# Altium project 红外数字模拟接收一体机.PrjPcb
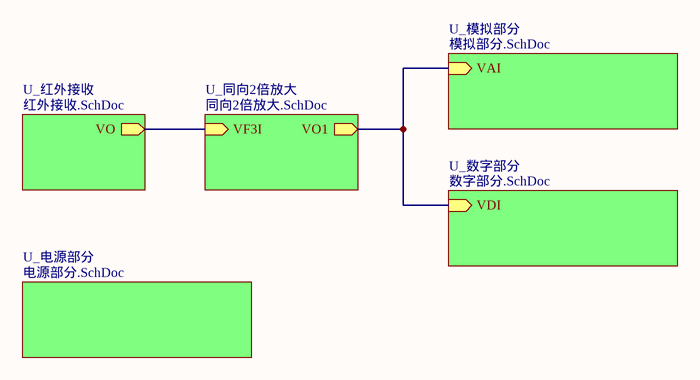
[diagram p0: 红外数字加模拟接收机.SchDoc]
15 sheets, 107 parts. Net scope: hierarchical (ports join the sheet entries above them; power ports are global).
Sheets:
  红外数字加模拟接收机.SchDoc
    U_模拟部分 = 模拟部分.SchDoc
      U_音频滤波 = 音频滤波.SchDoc
      U_功放TDA2030 = 功放TDA2030.SchDoc
    U_数字部分 = 数字部分.SchDoc
      U_LCD1602液晶显示 = LCD1602液晶显示.SchDoc
      U_峰值检波 = 峰值检波.SchDoc
      U_同向100倍放大 = 同向100倍放大.SchDoc
      U_同向10倍放大 = 同向10倍放大.SchDoc
      U_窄带滤波60K = 窄带滤波60K.SchDoc
      U_比较器 = 比较器.SchDoc
      U_51 最小系统 = 51 最小系统.SchDoc
    U_红外接收 = 红外接收.SchDoc
    U_同向2倍放大 = 同向2倍放大.SchDoc
    U_电源部分 = 电源部分.SchDoc

## Sheet 红外数字加模拟接收机.SchDoc
size A4

### Sub-sheets
U_同向2倍放大 = 同向2倍放大.SchDoc: VO1 (out), VF3I (in)
U_数字部分 = 数字部分.SchDoc: VDI (in)
U_模拟部分 = 模拟部分.SchDoc: VAI (in)
U_电源部分 = 电源部分.SchDoc: no entries
U_红外接收 = 红外接收.SchDoc: VO (out)

### Nets
NetC13_2: sheet U_红外接收/VO, sheet U_同向2倍放大/VF3I
NetR16_2: sheet U_模拟部分/VAI, sheet U_数字部分/VDI, sheet U_同向2倍放大/VO1

### Notes on the sheet
- 标题
- 日期
- 红外数字模拟接收一体机
- 2015 5 29
- 作者
- 模电组
- 单位
- 电子技术协会

## Sheet 模拟部分.SchDoc
size A4
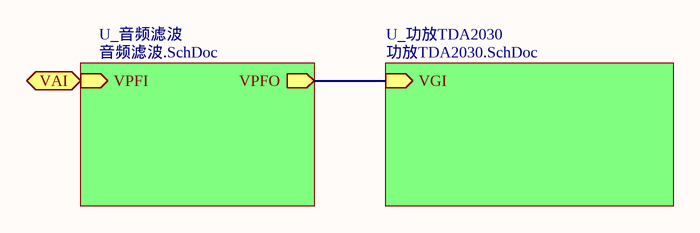
[diagram p1: 模拟部分.SchDoc]

### Sub-sheets
U_功放TDA2030 = 功放TDA2030.SchDoc: VGI (in)
U_音频滤波 = 音频滤波.SchDoc: VPFI (in), VPFO (out)

### Ports
VAI (in)

### Nets
NetR7_3: sheet U_音频滤波/VPFO, sheet U_功放TDA2030/VGI
NetR16_2: port VAI, sheet U_音频滤波/VPFI

### Notes on the sheet
- 标题
- 日期
- 红外数字模拟接收一体机
- 2015 5 29
- 作者
- 模电组
- 单位
- 电子技术协会

## Sheet 音频滤波.SchDoc
size A4
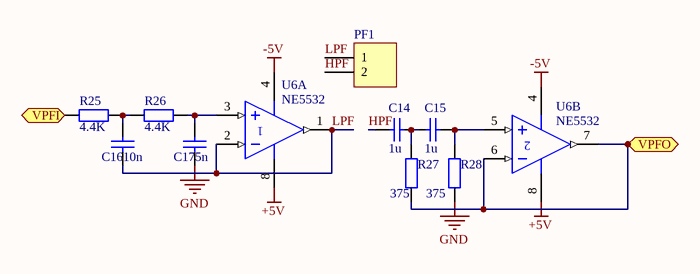
[diagram p2: 音频滤波.SchDoc]

### Parts
C14  瓷片电容  [瓷片电容]  (value not drawn)
C15  瓷片电容  [瓷片电容]  (value not drawn)
C16  瓷片电容  [瓷片电容]  (value not drawn)
C17  瓷片电容  [瓷片电容]  (value not drawn)
PF1  Header 2  [HDR1X2]  (value not drawn)
R25  value 4.4K  [AXIAL-0.4]  (hidden comment: Res2)
R26  value 4.4K  [AXIAL-0.4]  (hidden comment: Res2)
R27  value 375  [AXIAL-0.4]  (hidden comment: Res2)
R28  value 375  [AXIAL-0.4]  (hidden comment: Res2)
U6  NE5532  [JG008]  (parts A,B of 2)

### Ports
VPFI (in), VPFO (out)

### Nets
+5V: U6.8(V+)
-5V: U6.4(V-)
GND: C17.1 R28.1
HPF: C14.2 PF1.2
LPF: C16.1 PF1.1 U6.1(OUT) U6.2(IN-)
NetC14_1: C14.1 C15.2 R27.2
NetC15_1: C15.1 R28.2 U6.5(IN+)
NetC16_2: C16.2 R25.1 R26.2
NetC17_2: C17.2 R26.1 U6.3(IN+)
NetR7_3: R27.1 U6.6(IN-) U6.7(OUT) ; port VPFO
NetR16_2: R25.2 ; port VPFI

### Notes on the sheet
- 标题
- 日期
- 红外数字模拟接收一体机
- 2015 5 29
- 作者
- 模电组
- 单位
- 电子技术协会
- (in symbol 瓷片电容) 10n; 5n; 1u

### Library data of the parts
PF1 = Header 2: Header, 2-Pin; LatestRevisionDate: 17-Jul-2002; LatestRevisionNote: Re-released for DXP Platform.; Publisher: Altium Limited
R25-R28 = Res2: Resistor; Published: 8-Jun-2000; LatestRevisionDate: 17-Jul-2002; LatestRevisionNote: Re-released for DXP Platform.; PackageReference: AXIAL-0.4; Publisher: Altium Limited
U6 = NE5532AJG: Dual Low-Noise Operational Amplifier; Published: 15-Apr-2002; LatestRevisionDate: 04-Mar-2005; LatestRevisionNote: Stylized 3D Model Added.; DatasheetVersion: May-1988; PackageVersion: Jan-1995; PackageReference: JG008; Publisher: Altium Limited; PackageDescription: DIP; 8 Leads; Row Spacing 7.62 mm; Pitch 2.54 mm; ComponentLink1Description: Manufacturer Link; ComponentLink1URL: http://www.ti.com/; ComponentLink2Description: Datasheet; ComponentLink2URL: http://www-s.ti.com/sc/ds/ne5532a.pdf

## Sheet 功放TDA2030.SchDoc
size A4
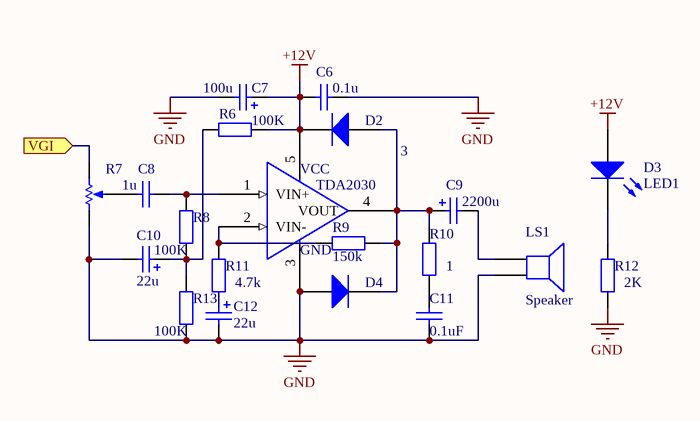
[diagram p3: 功放TDA2030.SchDoc]

### Parts
3  TDA2030  [TDA2030]
C6  瓷片电容  [瓷片电容]  (value not drawn)
C7  电解电容  [电解电容]  (value not drawn)
C8  独石电容  [独石电容]  (value not drawn)
C9  电解电容  [电解电容]  (value not drawn)
C10  电解电容  [电解电容]  (value not drawn)
C11  瓷片电容  [瓷片电容]  (value not drawn)
C12  电解电容  [电解电容]  (value not drawn)
D2  Diode 1N4007  [DO-41]  (value not drawn)
D3  LED1  [LED-1]
D4  Diode 1N4007  [DO-41]  (value not drawn)
LS1  Speaker  [PIN2]
R6  value 100K  [AXIAL-0.4]  (hidden comment: Res2)
R7  滑阻（功放用）  [多角滑阻]  (value not drawn)
R8  value 100K  [AXIAL-0.4]  (hidden comment: Res2)
R9  value 150k  [AXIAL-0.4]  (hidden comment: Res2)
R10  value 1  [AXIAL-0.4]  (hidden comment: Res2)
R11  value 4.7k  [AXIAL-0.4]  (hidden comment: Res2)
R12  value 2K  [AXIAL-0.4]  (hidden comment: Res2)
R13  value 100K  [AXIAL-0.4]  (hidden comment: Res2)

### Ports
VGI (in)

### Nets
+12V: 3.5(VCC) C6.1 C7.1 D2.2(K) D3.1(A) R6.2
GND: 3.3(GND) C6.2 C7.2 C10.2 C11.1 C12.2 D4.1(A) LS1.2 R7.1 R12.1 R13.1
Net3_1: 3.1(VIN+) C8.2 R8.2
Net3_2: 3.2(VIN-) R9.2 R11.2
Net3_4: 3.4(VOUT) C9.1 D2.1(A) D4.2(K) R9.1 R10.2
NetC8_1: C8.1 R7.2(TAP)
NetC9_2: C9.2 LS1.1
NetC10_1: C10.1 R6.1 R8.1 R13.2
NetC11_2: C11.2 R10.1
NetC12_1: C12.1 R11.1
NetD3_2: D3.2(K) R12.2
NetR7_3: R7.3 ; port VGI

### Notes on the sheet
- 标题
- 日期
- 红外数字模拟接收一体机
- 2015 5 29
- 作者
- 模电组
- 单位
- 电子技术协会
- (in symbol 独石电容) 1u
- (in symbol 瓷片电容) 0.1u; 0.1uF
- (in symbol 电解电容) 100u; 22u; 2200u

### Library data of the parts
D2 D4 = Diode 1N4007: 1 Amp General Purpose Rectifier; Published: 8-Jun-2000; LatestRevisionDate: 17-Jul-2002; LatestRevisionNote: Re-released for DXP Platform.; DatasheetDocument: 1998; PackageDocument: Aug-1999; PackageReference: DO-41; Publisher: Altium Limited; Code_JEDEC: DO-204-AL; ComponentLink1Description: Manufacturer Link; ComponentLink1URL: http://www.fairchildsemi.com/; ComponentLink2Description: Datasheet; ComponentLink2URL: http://www.fairchildsemi.com/ds/1N%2F1N4001.pdf
D3 = LED1: Typical RED GaAs LED; Published: 8-Jun-2000; LatestRevisionDate: 08-Jul-2005; LatestRevisionNote: Mech Layer 1 removed.; PackageReference: LED-1; Publisher: Altium Limited
LS1 = Speaker: Loudspeaker; Published: 24-Mar-1999; LatestRevisionDate: 17-Jul-2002; LatestRevisionNote: Re-released for DXP Platform.; PackageReference: PIN2; Publisher: Altium Limited
R6 R8-R13 = Res2: Resistor; Published: 8-Jun-2000; LatestRevisionDate: 17-Jul-2002; LatestRevisionNote: Re-released for DXP Platform.; PackageReference: AXIAL-0.4; Publisher: Altium Limited

## Sheet 数字部分.SchDoc
size A4
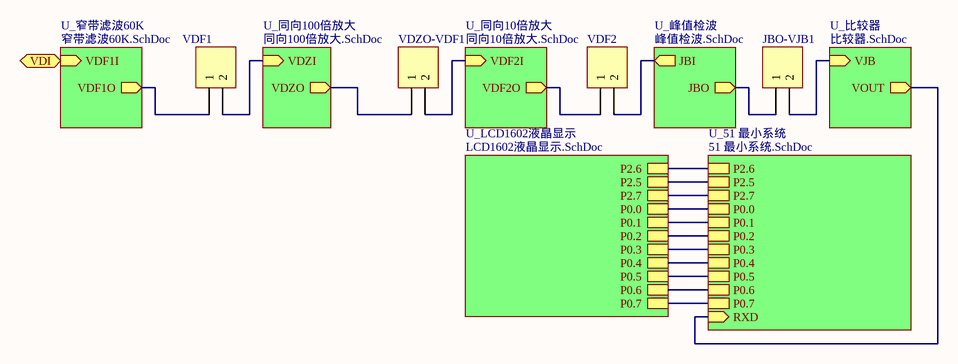
[diagram p4: 数字部分.SchDoc]

### Parts
JBO-VJB1  Header 2  [HDR1X2]  (value not drawn)
VDF1  Header 2  [HDR1X2]  (value not drawn)
VDF2  Header 2  [HDR1X2]  (value not drawn)
VDZO-VDF1  Header 2  [HDR1X2]  (value not drawn)

### Sub-sheets
U_51 最小系统 = 51 最小系统.SchDoc: P2.6, P2.5, P2.7, P0.0, P0.1, P0.2, P0.3, P0.4, P0.5, P0.6, P0.7, RXD (in)
U_LCD1602液晶显示 = LCD1602液晶显示.SchDoc: P2.6, P2.5, P2.7, P0.0, P0.1, P0.2, P0.3, P0.4, P0.5, P0.6, P0.7
U_同向10倍放大 = 同向10倍放大.SchDoc: VDF2I (in), VDF2O (out)
U_同向100倍放大 = 同向100倍放大.SchDoc: VDZI (in), VDZO (out)
U_峰值检波 = 峰值检波.SchDoc: JBI (out), JBO (out)
U_比较器 = 比较器.SchDoc: VJB (in), VOUT (out)
U_窄带滤波60K = 窄带滤波60K.SchDoc: VDF1I (in), VDF1O (out)

### Ports
VDI (in)

### Nets
Net1_10: sheet U_比较器/VOUT, sheet U_51 最小系统/RXD
Net1_26: sheet U_LCD1602液晶显示/P2.5, sheet U_51 最小系统/P2.5
Net1_27: sheet U_LCD1602液晶显示/P2.6, sheet U_51 最小系统/P2.6
Net1_28: sheet U_LCD1602液晶显示/P2.7, sheet U_51 最小系统/P2.7
Net1_32: sheet U_LCD1602液晶显示/P0.7, sheet U_51 最小系统/P0.7
Net1_33: sheet U_LCD1602液晶显示/P0.6, sheet U_51 最小系统/P0.6
Net1_34: sheet U_LCD1602液晶显示/P0.5, sheet U_51 最小系统/P0.5
Net1_35: sheet U_LCD1602液晶显示/P0.4, sheet U_51 最小系统/P0.4
Net1_36: sheet U_LCD1602液晶显示/P0.3, sheet U_51 最小系统/P0.3
Net1_37: sheet U_LCD1602液晶显示/P0.2, sheet U_51 最小系统/P0.2
Net1_38: sheet U_LCD1602液晶显示/P0.1, sheet U_51 最小系统/P0.1
Net1_39: sheet U_LCD1602液晶显示/P0.0, sheet U_51 最小系统/P0.0
NetC18_1: VDF1.1 ; sheet U_窄带滤波60K/VDF1O
NetC36_2: JBO-VJB1.1 ; sheet U_峰值检波/JBO
NetD1_1: VDF2.2 ; sheet U_峰值检波/JBI
NetJBO-VJB1_2: JBO-VJB1.2 ; sheet U_比较器/VJB
NetR16_2: port VDI, sheet U_窄带滤波60K/VDF1I
NetR19_2: VDF2.1 ; sheet U_同向10倍放大/VDF2O
NetR20_1: VDZO-VDF1.2 ; sheet U_同向10倍放大/VDF2I
NetR22_2: VDZO-VDF1.1 ; sheet U_同向100倍放大/VDZO
NetR23_1: VDF1.2 ; sheet U_同向100倍放大/VDZI

### Notes on the sheet
- 标题
- 日期
- 红外数字模拟接收一体机
- 2015 5 29
- 作者
- 模电组
- 单位
- 电子技术协会

### Library data of the parts
JBO-VJB1 VDF1 VDF2 VDZO-VDF1 = Header 2: Header, 2-Pin; LatestRevisionDate: 17-Jul-2002; LatestRevisionNote: Re-released for DXP Platform.; Publisher: Altium Limited

## Sheet LCD1602液晶显示.SchDoc
size A4
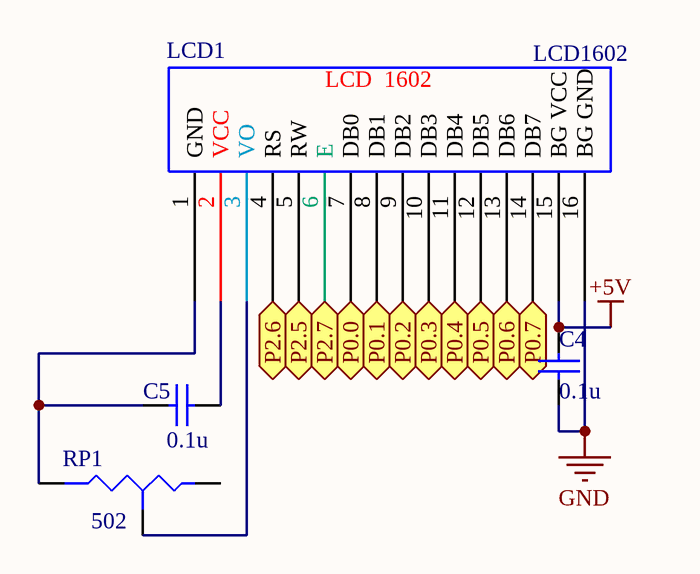
[diagram p5: LCD1602液晶显示.SchDoc]

### Parts
C4  瓷片电容  [瓷片电容]  (value not drawn)
C5  瓷片电容  [瓷片电容]  (value not drawn)
LCD1  LCD1602  [SIP16]
RP1  滑阻  [三脚滑阻]  (value not drawn)

### Ports
P0.0, P0.1, P0.2, P0.3, P0.4, P0.5, P0.6, P0.7, P2.5, P2.6, P2.7

### Nets
+5V: C4.1 LCD1.15(BG_VCC)
GND: C4.2 LCD1.16(BG_GND)
Net1_26: LCD1.5(RW) ; port P2.5
Net1_27: LCD1.4(RS) ; port P2.6
Net1_28: LCD1.6(E) ; port P2.7
Net1_32: LCD1.14(DB7) ; port P0.7
Net1_33: LCD1.13(DB6) ; port P0.6
Net1_34: LCD1.12(DB5) ; port P0.5
Net1_35: LCD1.11(DB4) ; port P0.4
Net1_36: LCD1.10(DB3) ; port P0.3
Net1_37: LCD1.9(DB2) ; port P0.2
Net1_38: LCD1.8(DB1) ; port P0.1
Net1_39: LCD1.7(DB0) ; port P0.0
NetC5_1: C5.1 LCD1.2(VCC)
NetC5_2: C5.2 LCD1.1(GND) RP1.3(B)
NetLCD1_3: LCD1.3(VO) RP1.2(TAP)

Not connected (* = marked no-connect by the designer): RP1 1(A)

### Notes on the sheet
- 标题
- 日期
- 红外数字模拟接收一体机
- 2015 5 29
- 作者
- 模电组
- 单位
- 电子技术协会
- (in symbol LCD1602) LCD  1602
- (in symbol 滑阻) 502
- (in symbol 瓷片电容) 0.1u

## Sheet 峰值检波.SchDoc
size A4
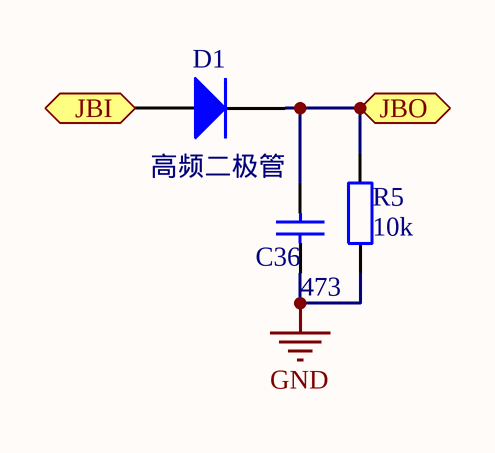
[diagram p6: 峰值检波.SchDoc]

### Parts
C36  瓷片电容  [瓷片电容]  (value not drawn)
D1  高频二极管  [DO-41]
R5  value 10k  [AXIAL-0.4]  (hidden comment: Res2)

### Ports
JBI (out), JBO (out)

### Nets
GND: C36.1 R5.1
NetC36_2: C36.2 D1.2(K) R5.2 ; port JBO
NetD1_1: D1.1(A) ; port JBI

### Notes on the sheet
- 标题
- 日期
- 红外数字模拟接收一体机
- 2015 5 29
- 作者
- 模电组
- 单位
- 电子技术协会
- (in symbol 瓷片电容) 473

### Library data of the parts
D1 = Diode 1N4007: 1 Amp General Purpose Rectifier; Published: 8-Jun-2000; LatestRevisionDate: 17-Jul-2002; LatestRevisionNote: Re-released for DXP Platform.; DatasheetDocument: 1998; PackageDocument: Aug-1999; PackageReference: DO-41; Publisher: Altium Limited; Code_JEDEC: DO-204-AL; ComponentLink1Description: Manufacturer Link; ComponentLink1URL: http://www.fairchildsemi.com/; ComponentLink2Description: Datasheet; ComponentLink2URL: http://www.fairchildsemi.com/ds/1N%2F1N4001.pdf
R5 = Res2: Resistor; Published: 8-Jun-2000; LatestRevisionDate: 17-Jul-2002; LatestRevisionNote: Re-released for DXP Platform.; PackageReference: AXIAL-0.4; Publisher: Altium Limited

## Sheet 同向100倍放大.SchDoc
size A4
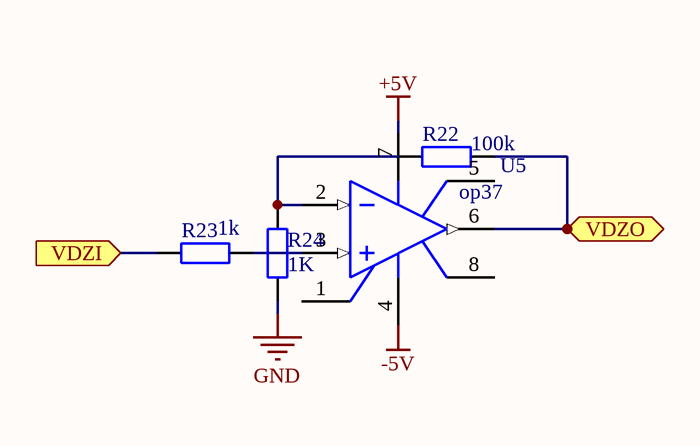
[diagram p7: 同向100倍放大.SchDoc]

### Parts
R22  value 100k  [AXIAL-0.4]  (hidden comment: Res2)
R23  value 1k  [AXIAL-0.4]  (hidden comment: Res2)
R24  value 1K  [AXIAL-0.4]  (hidden comment: Res2)
U5  op37  [N-8_A]

### Ports
VDZI (in), VDZO (out)

### Nets
+5V: U5.7(V+)
-5V: U5.4(V-)
GND: R24.1
NetR22_1: R22.1 R24.2 U5.2(IN-)
NetR22_2: R22.2 U5.6(OUT) ; port VDZO
NetR23_1: R23.1 ; port VDZI
NetR23_2: R23.2 U5.3(IN+)

Not connected (* = marked no-connect by the designer): U5 1(NULL1) 5(NC) 8(NULL2)

### Notes on the sheet
- 标题
- 日期
- 红外数字模拟接收一体机
- 2015 5 29
- 作者
- 模电组
- 单位
- 电子技术协会

### Library data of the parts
R22-R24 = Res2: Resistor; Published: 8-Jun-2000; LatestRevisionDate: 17-Jul-2002; LatestRevisionNote: Re-released for DXP Platform.; PackageReference: AXIAL-0.4; Publisher: Altium Limited
U5 = ADOP07CN: Ultra-Low Offset Voltage Operational Amplifier; Note: Pin 5 is not connected.; Published: 8-Jun-2000; LatestRevisionDate: 04-Mar-2005; LatestRevisionNote: Stylized 3D Model Added.; DatasheetVersion: 1992; PackageReference: N-8_A; Publisher: Altium Limited; PackageDescription: DIP; 8 Leads; Row Spacing 7.62 mm; Pitch 2.54 mm; Code_JEDEC: MO-001-AN; ComponentLink1Description: Manufacturer Link; ComponentLink1URL: http://www.analog.com/

## Sheet 同向10倍放大.SchDoc
size A4
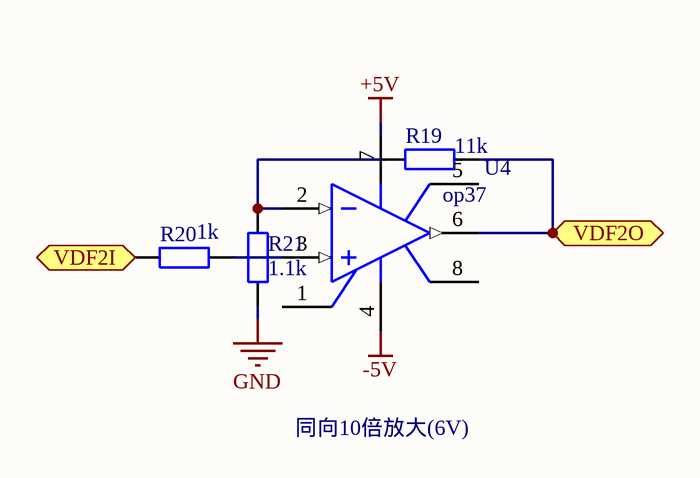
[diagram p8: 同向10倍放大.SchDoc]

### Parts
R19  value 11k  [AXIAL-0.4]  (hidden comment: Res2)
R20  value 1k  [AXIAL-0.4]  (hidden comment: Res2)
R21  value 1.1k  [AXIAL-0.4]  (hidden comment: Res2)
U4  op37  [N-8_A]

### Ports
VDF2I (in), VDF2O (out)

### Nets
+5V: U4.7(V+)
-5V: U4.4(V-)
GND: R21.1
NetR19_1: R19.1 R21.2 U4.2(IN-)
NetR19_2: R19.2 U4.6(OUT) ; port VDF2O
NetR20_1: R20.1 ; port VDF2I
NetR20_2: R20.2 U4.3(IN+)

Not connected (* = marked no-connect by the designer): U4 1(NULL1) 5(NC) 8(NULL2)

### Notes on the sheet
- 同向10倍放大(6V)
- 标题
- 日期
- 红外数字模拟接收一体机
- 2015 5 29
- 作者
- 模电组
- 单位
- 电子技术协会

### Library data of the parts
R19-R21 = Res2: Resistor; Published: 8-Jun-2000; LatestRevisionDate: 17-Jul-2002; LatestRevisionNote: Re-released for DXP Platform.; PackageReference: AXIAL-0.4; Publisher: Altium Limited
U4 = ADOP07CN: as U5 on sheet 同向100倍放大; Published: 8-Jun-2000; LatestRevisionDate: 04-Mar-2005; LatestRevisionNote: Stylized 3D Model Added.; DatasheetVersion: 1992; PackageReference: N-8_A; Publisher: Altium Limited; PackageDescription: DIP; 8 Leads; Row Spacing 7.62 mm; Pitch 2.54 mm; Code_JEDEC: MO-001-AN; ComponentLink1Description: Manufacturer Link; ComponentLink1URL: http://www.analog.com/

## Sheet 窄带滤波60K.SchDoc
size A4
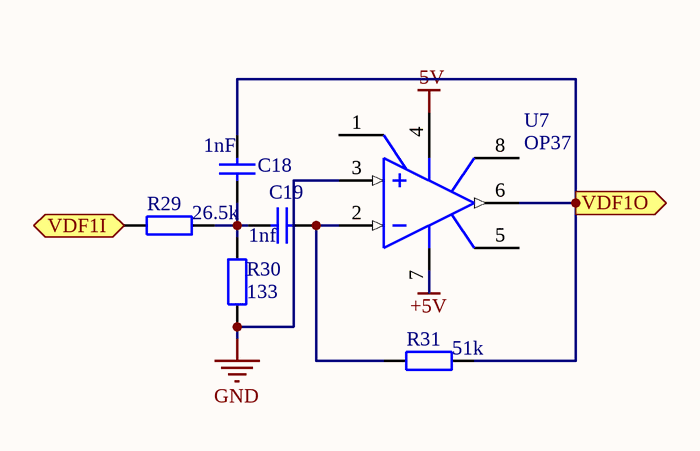
[diagram p9: 窄带滤波60K.SchDoc]

### Parts
C18  瓷片电容  [瓷片电容]  (value not drawn)
C19  瓷片电容  [瓷片电容]  (value not drawn)
R29  value 26.5k  [AXIAL-0.4]  (hidden comment: Res2)
R30  value 133  [AXIAL-0.4]  (hidden comment: Res2)
R31  value 51k  [AXIAL-0.4]  (hidden comment: Res2)
U7  OP37  [N-8_A]

### Ports
VDF1I (in), VDF1O (out)

### Nets
+5V: U7.7(V+)
-5V: U7.4(V-)
GND: R30.1 U7.3(IN+)
NetC18_1: C18.1 R31.2 U7.6(OUT) ; port VDF1O
NetC18_2: C18.2 C19.2 R29.2 R30.2
NetC19_1: C19.1 R31.1 U7.2(IN-)
NetR16_2: R29.1 ; port VDF1I

Not connected (* = marked no-connect by the designer): U7 1(NULL1) 5(NC) 8(NULL2)

### Notes on the sheet
- 标题
- 日期
- 红外数字模拟接收一体机
- 2015 5 29
- 作者
- 模电组
- 单位
- 电子技术协会
- (in symbol 瓷片电容) 1nf; 1nF

### Library data of the parts
R29-R31 = Res2: Resistor; Published: 8-Jun-2000; LatestRevisionDate: 17-Jul-2002; LatestRevisionNote: Re-released for DXP Platform.; PackageReference: AXIAL-0.4; Publisher: Altium Limited
U7 = ADOP07CN: as U5 on sheet 同向100倍放大; Published: 8-Jun-2000; LatestRevisionDate: 04-Mar-2005; LatestRevisionNote: Stylized 3D Model Added.; DatasheetVersion: 1992; PackageReference: N-8_A; Publisher: Altium Limited; PackageDescription: DIP; 8 Leads; Row Spacing 7.62 mm; Pitch 2.54 mm; Code_JEDEC: MO-001-AN; ComponentLink1Description: Manufacturer Link; ComponentLink1URL: http://www.analog.com/

## Sheet 比较器.SchDoc
size A4
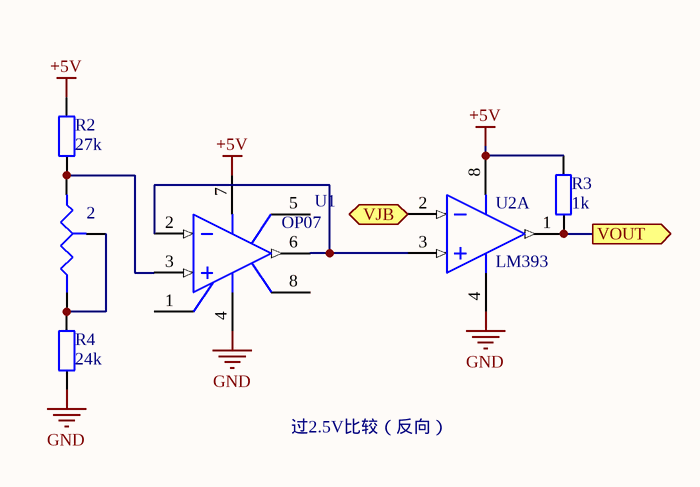
[diagram p10: 比较器.SchDoc]

### Parts
2  滑阻  [三脚滑阻]  (value not drawn)
R2  value 27k  [AXIAL-0.4]  (hidden comment: Res2)
R3  value 1k  [AXIAL-0.4]  (hidden comment: Res2)
R4  value 24k  [AXIAL-0.4]  (hidden comment: Res2)
U1  OP07  [N-8_A]
U2  LM393  [626-05]  (part A of 2)

### Ports
VJB (in), VOUT (out)

### Nets
+5V: R2.2 R3.2 U1.7(V+) U2.8(V+)
GND: R4.1 U1.4(V-) U2.4(GND)
Net1_10: R3.1 U2.1(OUT) ; port VOUT
Net2_1: 2.1(A) R2.1 U1.3(IN+)
Net2_2: 2.2(TAP) 2.3(B) R4.2
NetJBO-VJB1_2: U2.2(IN-) ; port VJB
NetU1_2: U1.2(IN-) U1.6(OUT) U2.3(IN+)

Not connected (* = marked no-connect by the designer): U1 1(NULL1) 5(NC) 8(NULL2)

### Notes on the sheet
- 过2.5V比较（反向）
- 标题
- 日期
- 红外数字模拟接收一体机
- 2015 5 29
- 作者
- 模电组
- 单位
- 电子技术协会

### Library data of the parts
R2-R4 = Res2: Resistor; Published: 8-Jun-2000; LatestRevisionDate: 17-Jul-2002; LatestRevisionNote: Re-released for DXP Platform.; PackageReference: AXIAL-0.4; Publisher: Altium Limited
U1 = ADOP07CN: as U5 on sheet 同向100倍放大; Published: 8-Jun-2000; LatestRevisionDate: 04-Mar-2005; LatestRevisionNote: Stylized 3D Model Added.; DatasheetVersion: 1992; PackageReference: N-8_A; Publisher: Altium Limited; PackageDescription: DIP; 8 Leads; Row Spacing 7.62 mm; Pitch 2.54 mm; Code_JEDEC: MO-001-AN; ComponentLink1Description: Manufacturer Link; ComponentLink1URL: http://www.analog.com/
U2 = LM393AN: Dual Comparator; Published: 17-Jul-2002; LatestRevisionDate: 06-Jun-2005; LatestRevisionNote: Stylized 3D Model Added.; DatasheetVersion: 1988; PackageReference: 626-05; Publisher: Altium Limited; PackageDescription: DIP; 8 Leads; Row Spacing 7.62 mm; Pitch 2.54 mm; ComponentLink1Description: Manufacturer Link; ComponentLink1URL: http://www.onsemi.com/site/products/taxonomy/0,4438,133,00.html

## Sheet 51 最小系统.SchDoc
size A4
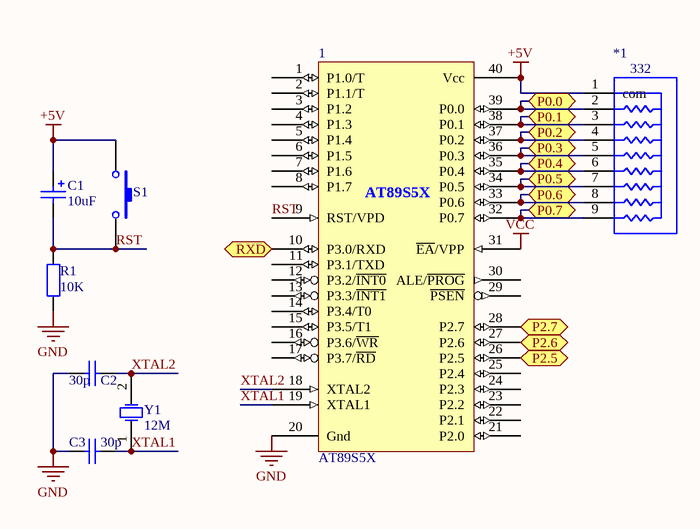
[diagram p11: 51 最小系统.SchDoc]

### Parts
1  AT89S5X  [DIP-40]
*1  排阻 DIP-9  [HDR1X9]  (value not drawn)
C1  电解电容  [电解电容]  (value not drawn)
C2  瓷片电容  [瓷片电容]  (value not drawn)
C3  瓷片电容  [瓷片电容]  (value not drawn)
R1  value 10K  [AXIAL-0.4]  (hidden comment: Res2)
S1  SW-PB  [SPST-2]  (value not drawn)
Y1  12M  [R38]

### Ports
P0.0, P0.1, P0.2, P0.3, P0.4, P0.5, P0.6, P0.7, P2.5, P2.6, P2.7, RXD (in)

### Nets
+5V: 1.40(Vcc) *1.1(com) C1.1 S1.1
GND: 1.20(Gnd) C2.1 C3.1 R1.1
VCC: 1.31(~{EA}/VPP)
RST: 1.9(RST/VPD) C1.2 R1.2 S1.2
XTAL1: 1.19(XTAL1) C3.2 Y1.1(OSC1)
XTAL2: 1.18(XTAL2) C2.2 Y1.2(OSC2)
Net1_10: 1.10(P3.0/RXD) ; port RXD
Net1_26: 1.26(P2.5) ; port P2.5
Net1_27: 1.27(P2.6) ; port P2.6
Net1_28: 1.28(P2.7) ; port P2.7
Net1_32: 1.32(P0.7) *1.9 ; port P0.7
Net1_33: 1.33(P0.6) *1.8 ; port P0.6
Net1_34: 1.34(P0.5) *1.7 ; port P0.5
Net1_35: 1.35(P0.4) *1.6 ; port P0.4
Net1_36: 1.36(P0.3) *1.5 ; port P0.3
Net1_37: 1.37(P0.2) *1.4 ; port P0.2
Net1_38: 1.38(P0.1) *1.3 ; port P0.1
Net1_39: 1.39(P0.0) *1.2 ; port P0.0

Not connected (* = marked no-connect by the designer): 1 1(P1.0/T) 2(P1.1/T) 3(P1.2) 4(P1.3) 5(P1.4) 6(P1.5) 7(P1.6) 8(P1.7) 11(P3.1/TXD) 12(P3.2/~{INT0}) 13(P3.3/~{INT1}) 14(P3.4/T0) 15(P3.5/T1) 16(P3.6/~{WR}) 17(P3.7/~{RD}) 21(P2.0) 22(P2.1) 23(P2.2) 24(P2.3) 25(P2.4) 29(~{PSEN}) 30(ALE/~{PROG})

### Notes on the sheet
- 标题
- 日期
- 红外数字模拟接收一体机
- 2015 5 29
- 作者
- 模电组
- 单位
- 电子技术协会
- (in symbol 排阻 DIP-9) 332
- (in symbol 瓷片电容) 30p
- (in symbol 电解电容) 10uF

### Library data of the parts
R1 = Res2: Resistor; Published: 8-Jun-2000; LatestRevisionDate: 17-Jul-2002; LatestRevisionNote: Re-released for DXP Platform.; PackageReference: AXIAL-0.4; Publisher: Altium Limited
S1 = SW-PB: Switch; Published: 24-Mar-1999; LatestRevisionDate: 17-Jul-2002; LatestRevisionNote: Re-released for DXP Platform.; PackageReference: SPST-2; Publisher: Altium Limited
Y1 = XTAL: Crystal Oscillator; Published: 8-Jun-2000; LatestRevisionDate: 17-Jul-2002; LatestRevisionNote: Re-released for DXP Platform.; PackageReference: R38; Publisher: Altium Limited

## Sheet 红外接收.SchDoc
size A4
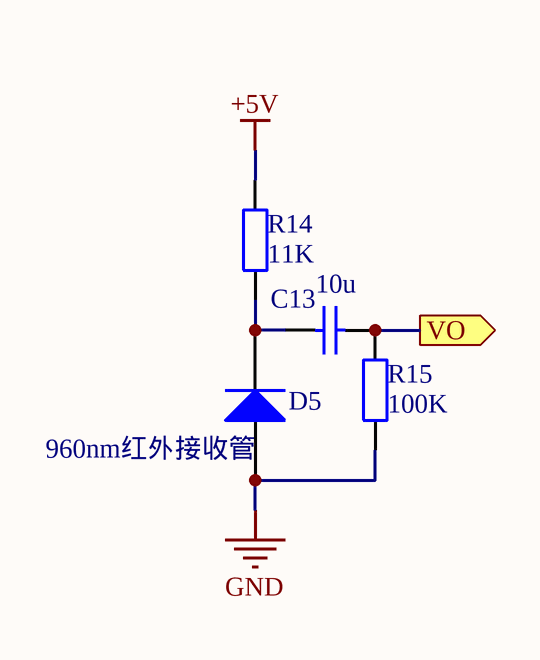
[diagram p12: 红外接收.SchDoc]

### Parts
C13  独石电容  [独石电容]  (value not drawn)
D5  960nm红外接收管  [DO-41]
R14  value 11K  [AXIAL-0.4]  (hidden comment: Res2)
R15  value 100K  [AXIAL-0.4]  (hidden comment: Res2)

### Ports
VO (out)

### Nets
+5V: R14.2
GND: D5.1(A) R15.1
NetC13_1: C13.1 D5.2(K) R14.1
NetC13_2: C13.2 R15.2 ; port VO

### Notes on the sheet
- 标题
- 日期
- 红外数字模拟接收一体机
- 2015 5 29
- 作者
- 模电组
- 单位
- 电子技术协会
- (in symbol 独石电容) 10u

### Library data of the parts
D5 = Diode 1N4001: 1 Amp General Purpose Rectifier; Published: 8-Jun-2000; LatestRevisionDate: 17-Jul-2002; LatestRevisionNote: Re-released for DXP Platform.; DatasheetDocument: 1998; PackageDocument: Aug-1999; PackageReference: DO-41; Publisher: Altium Limited; Code_JEDEC: DO-204-AL; ComponentLink1Description: Manufacturer Link; ComponentLink1URL: http://www.fairchildsemi.com/; ComponentLink2Description: Datasheet; ComponentLink2URL: http://www.fairchildsemi.com/ds/1N%2F1N4001.pdf
R14 R15 = Res2: Resistor; Published: 8-Jun-2000; LatestRevisionDate: 17-Jul-2002; LatestRevisionNote: Re-released for DXP Platform.; PackageReference: AXIAL-0.4; Publisher: Altium Limited

## Sheet 同向2倍放大.SchDoc
size A4
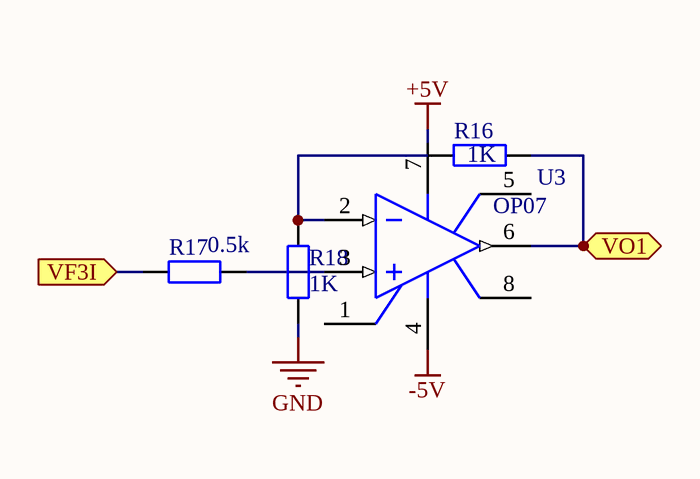
[diagram p13: 同向2倍放大.SchDoc]

### Parts
R16  value 1K  [AXIAL-0.4]  (hidden comment: Res2)
R17  value 0.5k  [AXIAL-0.4]  (hidden comment: Res2)
R18  value 1K  [AXIAL-0.4]  (hidden comment: Res2)
U3  OP07  [N-8_A]

### Ports
VF3I (in), VO1 (out)

### Nets
+5V: U3.7(V+)
-5V: U3.4(V-)
GND: R18.1
NetC13_2: R17.1 ; port VF3I
NetR16_1: R16.1 R18.2 U3.2(IN-)
NetR16_2: R16.2 U3.6(OUT) ; port VO1
NetR17_2: R17.2 U3.3(IN+)

Not connected (* = marked no-connect by the designer): U3 1(NULL1) 5(NC) 8(NULL2)

### Notes on the sheet
- 标题
- 日期
- 红外数字模拟接收一体机
- 2015 5 29
- 作者
- 模电组
- 单位
- 电子技术协会

### Library data of the parts
R16-R18 = Res2: Resistor; Published: 8-Jun-2000; LatestRevisionDate: 17-Jul-2002; LatestRevisionNote: Re-released for DXP Platform.; PackageReference: AXIAL-0.4; Publisher: Altium Limited
U3 = ADOP07CN: as U5 on sheet 同向100倍放大; Published: 8-Jun-2000; LatestRevisionDate: 04-Mar-2005; LatestRevisionNote: Stylized 3D Model Added.; DatasheetVersion: 1992; PackageReference: N-8_A; Publisher: Altium Limited; PackageDescription: DIP; 8 Leads; Row Spacing 7.62 mm; Pitch 2.54 mm; Code_JEDEC: MO-001-AN; ComponentLink1Description: Manufacturer Link; ComponentLink1URL: http://www.analog.com/

## Sheet 电源部分.SchDoc
size A4
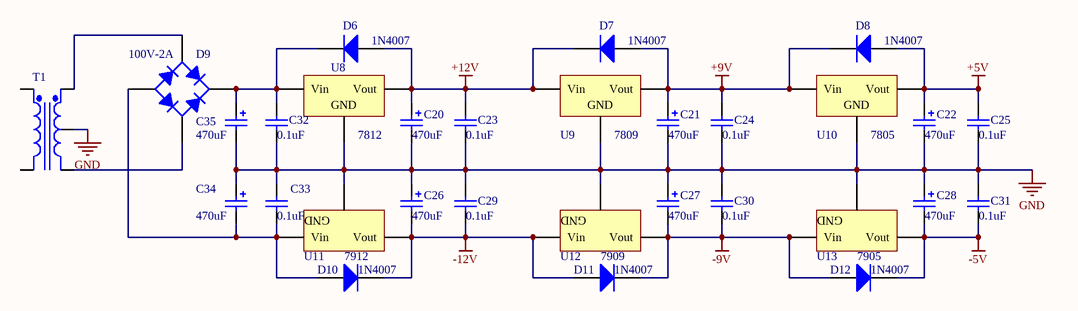
[diagram p14: 电源部分.SchDoc]

### Parts
C20  (no value)  [电解电容]
C21  (no value)  [电解电容]
C22  (no value)  [电解电容]
C23  瓷片电容  [瓷片电容]  (value not drawn)
C24  瓷片电容  [瓷片电容]  (value not drawn)
C25  瓷片电容  [瓷片电容]  (value not drawn)
C26  (no value)  [电解电容]
C27  (no value)  [电解电容]
C28  (no value)  [电解电容]
C29  瓷片电容  [瓷片电容]  (value not drawn)
C30  瓷片电容  [瓷片电容]  (value not drawn)
C31  瓷片电容  [瓷片电容]  (value not drawn)
C32  瓷片电容  [瓷片电容]  (value not drawn)
C33  瓷片电容  [瓷片电容]  (value not drawn)
C34  (no value)  [电解电容]
C35  (no value)  [电解电容]
D6  1N4007  [DO-41]
D7  1N4007  [DO-41]
D8  1N4007  [DO-41]
D9  100V-2A  [D-38]
D10  1N4007  [DO-41]
D11  1N4007  [DO-41]
D12  1N4007  [DO-41]
T1  Trans CT  [TRF_5]  (value not drawn)
U8  7812  [78**]
U9  7809  [78**]
U10  7805  [78**]
U11  7912  [79**]
U12  7909  [79**]
U13  7905  [79**]

### Nets
+5V: C22.1 C25.2 D8.1(A) U10.3(Vout)
+9V: C21.1 C24.2 D7.1(A) D8.2(K) U9.3(Vout) U10.1(Vin)
+12V: C20.1 C23.2 D6.1(A) D7.2(K) U8.3(Vout) U9.1(Vin)
-5V: C28.2 C31.1 D12.2(K) U13.3(Vout)
-9V: C27.2 C30.1 D11.2(K) D12.1(A) U12.3(Vout) U13.1(Vin)
-12V: C26.2 C29.1 D10.2(K) D11.1(A) U11.3(Vout) U12.1(Vin)
GND: C20.2 C21.2 C22.2 C23.1 C24.1 C25.1 C26.1 C27.1 C28.1 C29.2 C30.2 C31.2 C32.1 C33.2 C34.1 C35.2 T1.4(SecCT) U8.2(GND) U9.2(GND) U10.2(GND) U11.2(GND) U12.2(GND) U13.2(GND)
NetC32_2: C32.2 C35.1 D6.2(K) D9.3(K) U8.1(Vin)
NetC33_1: C33.1 C34.2 D9.1(A) D10.1(A) U11.1(Vin)
NetD9_2: D9.2(C) T1.3(Sec+)
NetD9_4: D9.4(C) T1.5(Sec-)

Not connected (* = marked no-connect by the designer): T1 1(Pri+) 2(Pri-)

### Notes on the sheet
- 标题
- 日期
- 红外数字模拟接收一体机
- 2015 5 29
- 作者
- 模电组
- 单位
- 电子技术协会
- (in symbol 瓷片电容) 0.1uF
- (in symbol 电解电容) 470uF

### Library data of the parts
C20-C22 C26-C28 C34 C35 = 电解电容
D6-D8 D10-D12 = Diode 1N4007: 1 Amp General Purpose Rectifier; Published: 8-Jun-2000; LatestRevisionDate: 17-Jul-2002; LatestRevisionNote: Re-released for DXP Platform.; DatasheetDocument: 1998; PackageDocument: Aug-1999; PackageReference: DO-41; Publisher: Altium Limited; Code_JEDEC: DO-204-AL; ComponentLink1Description: Manufacturer Link; ComponentLink1URL: http://www.fairchildsemi.com/; ComponentLink2Description: Datasheet; ComponentLink2URL: http://www.fairchildsemi.com/ds/1N%2F1N4001.pdf
D9 = Bridge1: Full Wave Diode Bridge; Published: 8-Jun-2000; LatestRevisionDate: 17-Jul-2002; LatestRevisionNote: Re-released for DXP Platform.; PackageReference: D-38; Publisher: Altium Limited
T1 = Trans CT: Center-Tapped Transformer (Coupled Inductor Model); Published: 8-Jun-2000; LatestRevisionDate: 17-Jul-2002; LatestRevisionNote: Re-released for DXP Platform.; PackageReference: TRF_5; Publisher: Altium Limited
U8-U13 = Volt Reg: Voltage Regulator; Published: 24-Mar-1999; LatestRevisionDate: 17-Jul-2002; LatestRevisionNote: Re-released for DXP Platform.; PackageReference: D2PAK; Publisher: Altium Limited; Code_JEDEC: SMD-220

## Nets that join several sheets
+5V: 音频滤波 (U6.8), LCD1602液晶显示 (C4.1 LCD1.15), 同向100倍放大 (U5.7), 同向10倍放大 (U4.7), 窄带滤波60K (U7.7), 比较器 (R2.2 R3.2 U1.7 U2.8), 51 最小系统 (1.40 *1.1 C1.1 S1.1), 红外接收 (R14.2), 同向2倍放大 (U3.7), 电源部分 (C22.1 C25.2 D8.1 U10.3)
+12V: 功放TDA2030 (6 pins), 电源部分 (6 pins)
-5V: 音频滤波 (U6.4), 同向100倍放大 (U5.4), 同向10倍放大 (U4.4), 窄带滤波60K (U7.4), 同向2倍放大 (U3.4), 电源部分 (C28.2 C31.1 D12.2 U13.3)
GND: 音频滤波 (C17.1 R28.1), 功放TDA2030 (11 pins), LCD1602液晶显示 (C4.2 LCD1.16), 峰值检波 (C36.1 R5.1), 同向100倍放大 (R24.1), 同向10倍放大 (R21.1), 窄带滤波60K (R30.1 U7.3), 比较器 (R4.1 U1.4 U2.4), 51 最小系统 (1.20 C2.1 C3.1 R1.1), 红外接收 (D5.1 R15.1), 同向2倍放大 (R18.1), 电源部分 (23 pins)
Net1_10: 比较器 (R3.1 U2.1), 51 最小系统 (1.10)
Net1_26: LCD1602液晶显示 (LCD1.5), 51 最小系统 (1.26)
Net1_27: LCD1602液晶显示 (LCD1.4), 51 最小系统 (1.27)
Net1_28: LCD1602液晶显示 (LCD1.6), 51 最小系统 (1.28)
Net1_32: LCD1602液晶显示 (LCD1.14), 51 最小系统 (1.32 *1.9)
Net1_33: LCD1602液晶显示 (LCD1.13), 51 最小系统 (1.33 *1.8)
Net1_34: LCD1602液晶显示 (LCD1.12), 51 最小系统 (1.34 *1.7)
Net1_35: LCD1602液晶显示 (LCD1.11), 51 最小系统 (1.35 *1.6)
Net1_36: LCD1602液晶显示 (LCD1.10), 51 最小系统 (1.36 *1.5)
Net1_37: LCD1602液晶显示 (LCD1.9), 51 最小系统 (1.37 *1.4)
Net1_38: LCD1602液晶显示 (LCD1.8), 51 最小系统 (1.38 *1.3)
Net1_39: LCD1602液晶显示 (LCD1.7), 51 最小系统 (1.39 *1.2)
NetC13_2: 红外接收 (C13.2 R15.2), 同向2倍放大 (R17.1)
NetC18_1: 数字部分 (VDF1.1), 窄带滤波60K (C18.1 R31.2 U7.6)
NetC36_2: 数字部分 (JBO-VJB1.1), 峰值检波 (C36.2 D1.2 R5.2)
NetD1_1: 数字部分 (VDF2.2), 峰值检波 (D1.1)
NetJBO-VJB1_2: 数字部分 (JBO-VJB1.2), 比较器 (U2.2)
NetR7_3: 音频滤波 (R27.1 U6.6 U6.7), 功放TDA2030 (R7.3)
NetR16_2: 音频滤波 (R25.2), 窄带滤波60K (R29.1), 同向2倍放大 (R16.2 U3.6)
NetR19_2: 数字部分 (VDF2.1), 同向10倍放大 (R19.2 U4.6)
NetR20_1: 数字部分 (VDZO-VDF1.2), 同向10倍放大 (R20.1)
NetR22_2: 数字部分 (VDZO-VDF1.1), 同向100倍放大 (R22.2 U5.6)
NetR23_1: 数字部分 (VDF1.2), 同向100倍放大 (R23.1)